# Altium schematic sheet switch_amp.SchDoc
size A; SheetNumber: 8; SheetTotal: 10
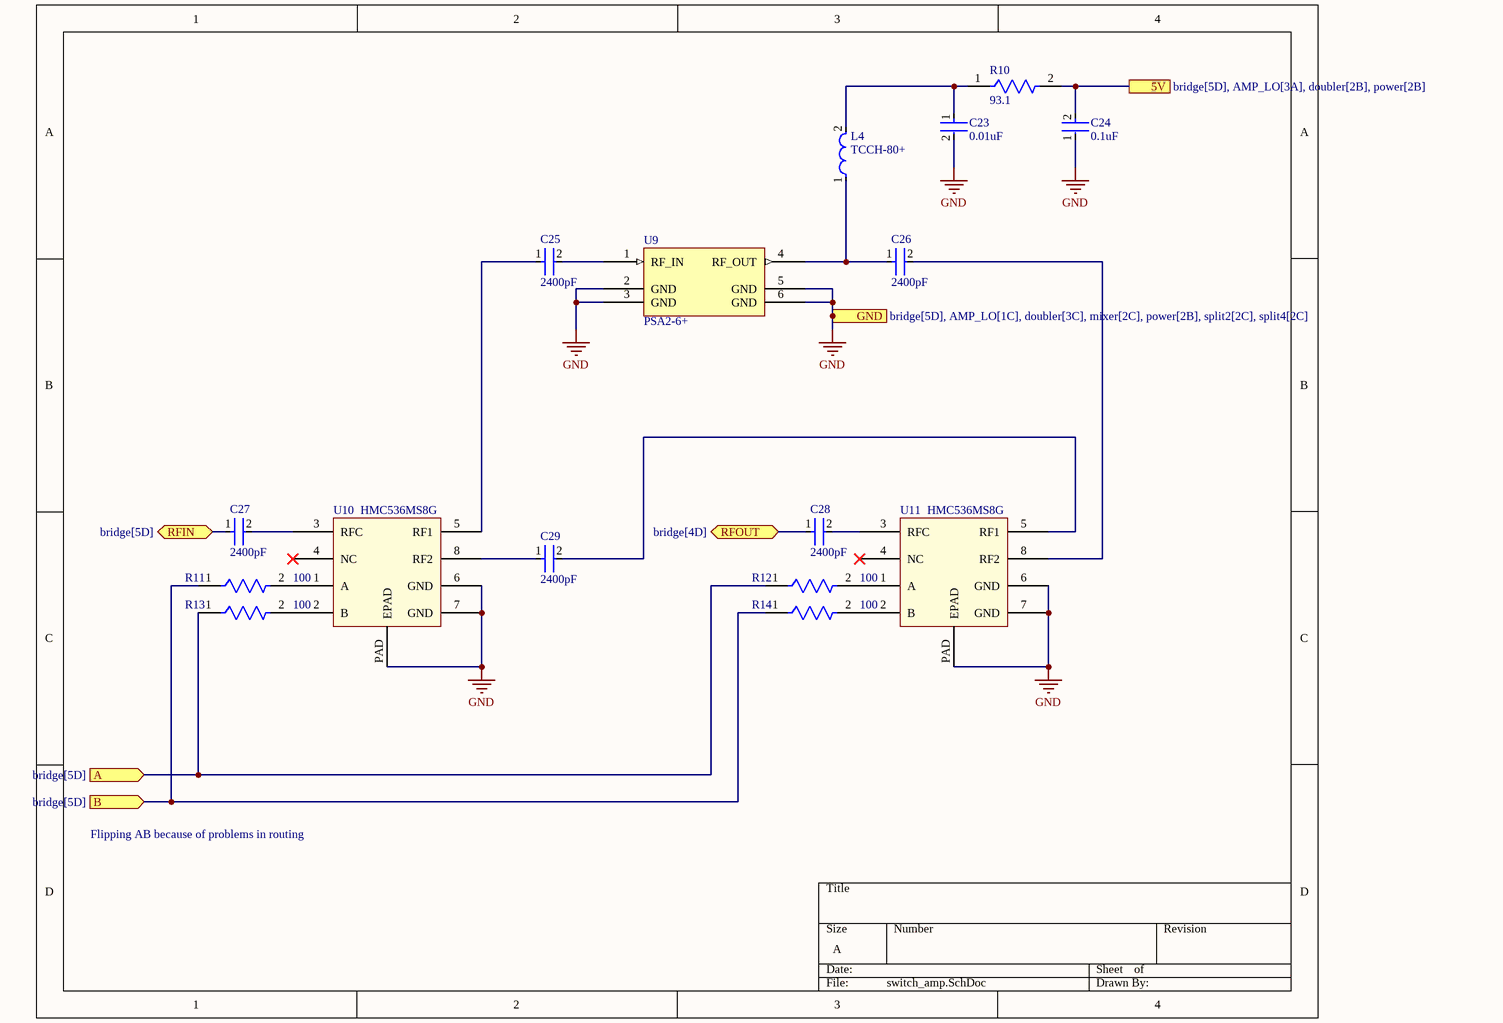
[diagram p0: switch_amp.SchDoc]

## Parts
C23  0.01uF  [FP-GRM188-0_1-e0_2_0_5-IPC_B]
C24  0.1uF  [FP-GCJ188-0_2-IPC_C]
C25  2400pF  [FP-GRM188-0_1-e0_2_0_5-MFG]
C26  2400pF  [FP-GRM188-0_1-e0_2_0_5-MFG]
C27  2400pF  [FP-GRM188-0_1-e0_2_0_5-MFG]
C28  2400pF  [FP-GRM188-0_1-e0_2_0_5-MFG]
C29  2400pF  [FP-GRM188-0_1-e0_2_0_5-MFG]
L4  TCCH-80+  [FP-IFSC1515AH-MFG]
R10  93.1  [FP-CRCW0805-e3-MFG]
R11  100  [FP-RC0603-0_55-MFG]
R12  100  [FP-RC0603-0_55-MFG]
R13  100  [FP-RC0603-0_55-MFG]
R14  100  [FP-RC0603-0_55-MFG]
U9  PSA2-6+  [PSA2-6+ SOT-363]
U10  HMC536MS8G  [RH_8_1_ADI]
U11  HMC536MS8G  [RH_8_1_ADI]

## Ports
5V (see bridge[5D], AMP_LO[3A], doubler[2B], power[2B]), A (in, see bridge[5D]), B (in, see bridge[5D]), GND (see bridge[5D], AMP_LO[1C], doubler[3C], mixer[2C], power[2B], split2[2C], split4[2C]), RFIN (bidir, see bridge[5D]), RFOUT (bidir, see bridge[4D])

## Nets
GND: C23.2 C24.1 U9.2(GND) U9.3(GND) U9.5(GND) U9.6(GND) U10.6(GND) U10.7(GND) U10.PAD(EPAD) U11.6(GND) U11.7(GND) U11.PAD(EPAD) ; port GND
5V: C24.2 R10.2 ; port 5V
A: R12.1 R13.1 ; port A
B: R11.1 R14.1 ; port B
RFIN: C27.1 ; port RFIN
RFOUT: C28.1 ; port RFOUT
NetC23_1: C23.1 L4.2 R10.1
NetC25_1: C25.1 U10.5(RF1)
NetC25_2: C25.2 U9.1(RF_IN)
NetC26_1: C26.1 L4.1 U9.4(RF_OUT)
NetC26_2: C26.2 U11.8(RF2)
NetC27_2: C27.2 U10.3(RFC)
NetC28_2: C28.2 U11.3(RFC)
NetC29_1: C29.1 U10.8(RF2)
NetC29_2: C29.2 U11.5(RF1)
NetR11_2: R11.2 U10.1(A)
NetR12_2: R12.2 U11.1(A)
NetR13_2: R13.2 U10.2(B)
NetR14_2: R14.2 U11.2(B)

Not connected (* = marked no-connect by the designer): U10 4(NC)*; U11 4(NC)*

## Notes on the sheet
- Flipping AB because of problems in routing

## Library data of the parts
C23 = CMP-2006-02556-2: GRM1885C1H103JA01D; Chip Multilayer Ceramic Capacitors for General Purpose, 0603, 10000pF, C0G, 30ppm/°C, 5%, 50V; Capacitance: 10nF; Voltage Rating: 50V; Height: 0.8mm; Thickness: 0.035inch; Termination: SMD/SMT; Width: 0.8mm; Case/Package: 0603; Package Quantity: 4000; Max Operating Temperature: 125°C; Voltage Rating (DC): 50V; Lead Free: Lead Free; Mount: Surface Mount; Depth: 0.8mm; REACH SVHC: No SVHC; Voltage: 50V; Material: Ceramic; Tolerance: 5%; Case Code (Metric): 1608; Dielectric: C0G; Case Code (Imperial): 0603; Lead Pitch: 0.5mm; Length: 1.6mm; Min Operating Temperature: -55°C; Packaging: Tape and Reel
C24 = CMP-2006-02223-2: GCJ188R71H104KA12D: Cap Ceramic 0.1uF 50V X7R 10% Pad SMD 0603 Soft Termination +125°C Automotive T/R; Capacitance: 100nF; Radiation Hardening: No; Dielectric: X7R; Voltage Rating (DC): 50V; Case Code (Imperial): 0603; Length: 1.6mm; Features: Soft Termination; Case Code (Metric): 1608; Case/Package: 0603; Termination: SMD/SMT; Packaging: Tape and Reel; Height: 0.8mm; Tolerance: 10%; Thickness: 0.035inch; Width: 0.031inch; Voltage Rating: 50V; Min Operating Temperature: -55°C; Ratings: AEC-Q200; Package Quantity: 1; Depth: 0.8mm; Mount: Surface Mount; Lead Free: Lead Free; Max Operating Temperature: 125°C
C25-C29 = CMP-2006-02639-2: GRM1885C1H242JA01D; Chip Multilayer Ceramic Capacitors for General Purpose, 0603, 2400pF, C0G, 30ppm/°C, 5%, 50V; Capacitance: 2.4nF; Max Operating Temperature: 125°C; Thickness: 0.035inch; Width: 0.031inch; Voltage Rating (DC): 50V; Voltage Rating: 50V; Length: 1.6mm; Dielectric: C0G; Radiation Hardening: No; Lead Free: Lead Free; Case/Package: 0603; Height: 0.8mm; Termination: SMD/SMT; Tolerance: 5%; Case Code (Imperial): 0603; Voltage: 50V; Depth: 0.8mm; Mount: Surface Mount; Case Code (Metric): 1608; Packaging: Tape and Reel; Package Quantity: 4000; Min Operating Temperature: -55°C
L4 = CMP-02424-000001-1: FIXED IND 4UH 200MA 100MOHM SMD; Manufacturer: Vishay; Manufacturer Part Number: IFSC1515AHER470M01; Shielding: true; Saturation Current: 0.58uA; Inductance: 47uH; Rms Current: 0.8A; Tolerance: 20%; Test Frequency: 100kHz; Series Resistance: 594mΩ; Device Class L2: Inductors; Device Class L3: Fixed Inductors; Device Class L1: Passive Components; Digikey Description: FIXED IND 47UH 800MA 594 MOHM; Automotive: No; Category: Ind; Lead Free: Yes; ComponentLink2URL: http://www.vishay.com/docs/34295/sc15ah01.pdf; Temperature Range High: +125°C; Temperature Range Low: -55°C; Value: 4uH; ComponentLink2Description: Datasheet; Temperature: -55°C to +125°C; Height: 1.9mm; RoHS: TRUE; Octopart: https://octopart.com/ifsc1515aher470m01-vishay-44633162; Package: IFSC1515AH; Mouser Description: Fixed Inductors 47uH 20%
R10 = CMP-2001-04168-2: CRCW080593R1FKEA; RES Thick Film, 93.1Ω, 1%, 0.125W, 100ppm/°C, 0805; Resistance: 93.1R; Voltage Rating: 150V; Power Rating: 125mW; Tolerance: 1%; Features: Automotive AEC-Q200; Number of Terminations: 2; Case Code (Metric): 2012; Mount: Surface Mount; Case Code (Imperial): 0805; Weight: 0.000194oz; Package Quantity: 10; Length: 2mm; Temperature Coefficient: 100ppm/°C; Composition: Thick Film; Depth: 1.25mm; Case/Package: 0805; Number of Pins: 2; Max Operating Temperature: 155°C; Lead Free: Lead Free; Width: 1.25mm; Voltage Rating (DC): 150V; Military Standard: Not; Height: 0.02inch; Radiation Hardening: No; Contact Plating: Tin; Min Operating Temperature: -55°C; Max Power Dissipation: 125mW; Packaging: Tape and Reel
R11-R14 = CMP-2000-05021-2: RES SMD 100 OHM 5% 1/10W 0603; Temperature Coefficient: 100ppm/°C; Voltage Rating (DC): 50V; Power Rating: 100mW; Resistance: 100R; Features: Moisture Resistant; Width: 0.8mm; RoHS Compliant: Yes; Series: RC; Case Code (Metric): 1608; Packaging: Tape and Reel; Construction: Rectangular; Contact Plating: Tin; Resistor Type: Thick Film; Case/Package: 0603; Military Standard: Not; Case Code (Imperial): 0603; Number of Pins: 2; Length: 1.6mm; Size Code: 0603; Voltage Rating: 50V; Min Operating Temperature: -55°C; Max Power Dissipation: 100mW; Tolerance: 5%; Lead Free: Lead Free; Termination: SMD/SMT; Resistance Tolerance: 5%; Depth: 0.8mm; Max Operating Temperature: 155°C; Number of Terminations: 2; Radiation Hardening: No
U9 = PSA2-6+: SMT MMIC, Linear, Gain Block Amplifier, DC to 7000 MHz, 50Ω, SOT-363 Style Package
U10 U11 = HMC536MS8G: RF Switch ICs 3 Watt SPDT T/R Switch SMT, DC - 6 GHz